# EAGLE design brick_i2c_ktemp (EAGLE 7.4.0)
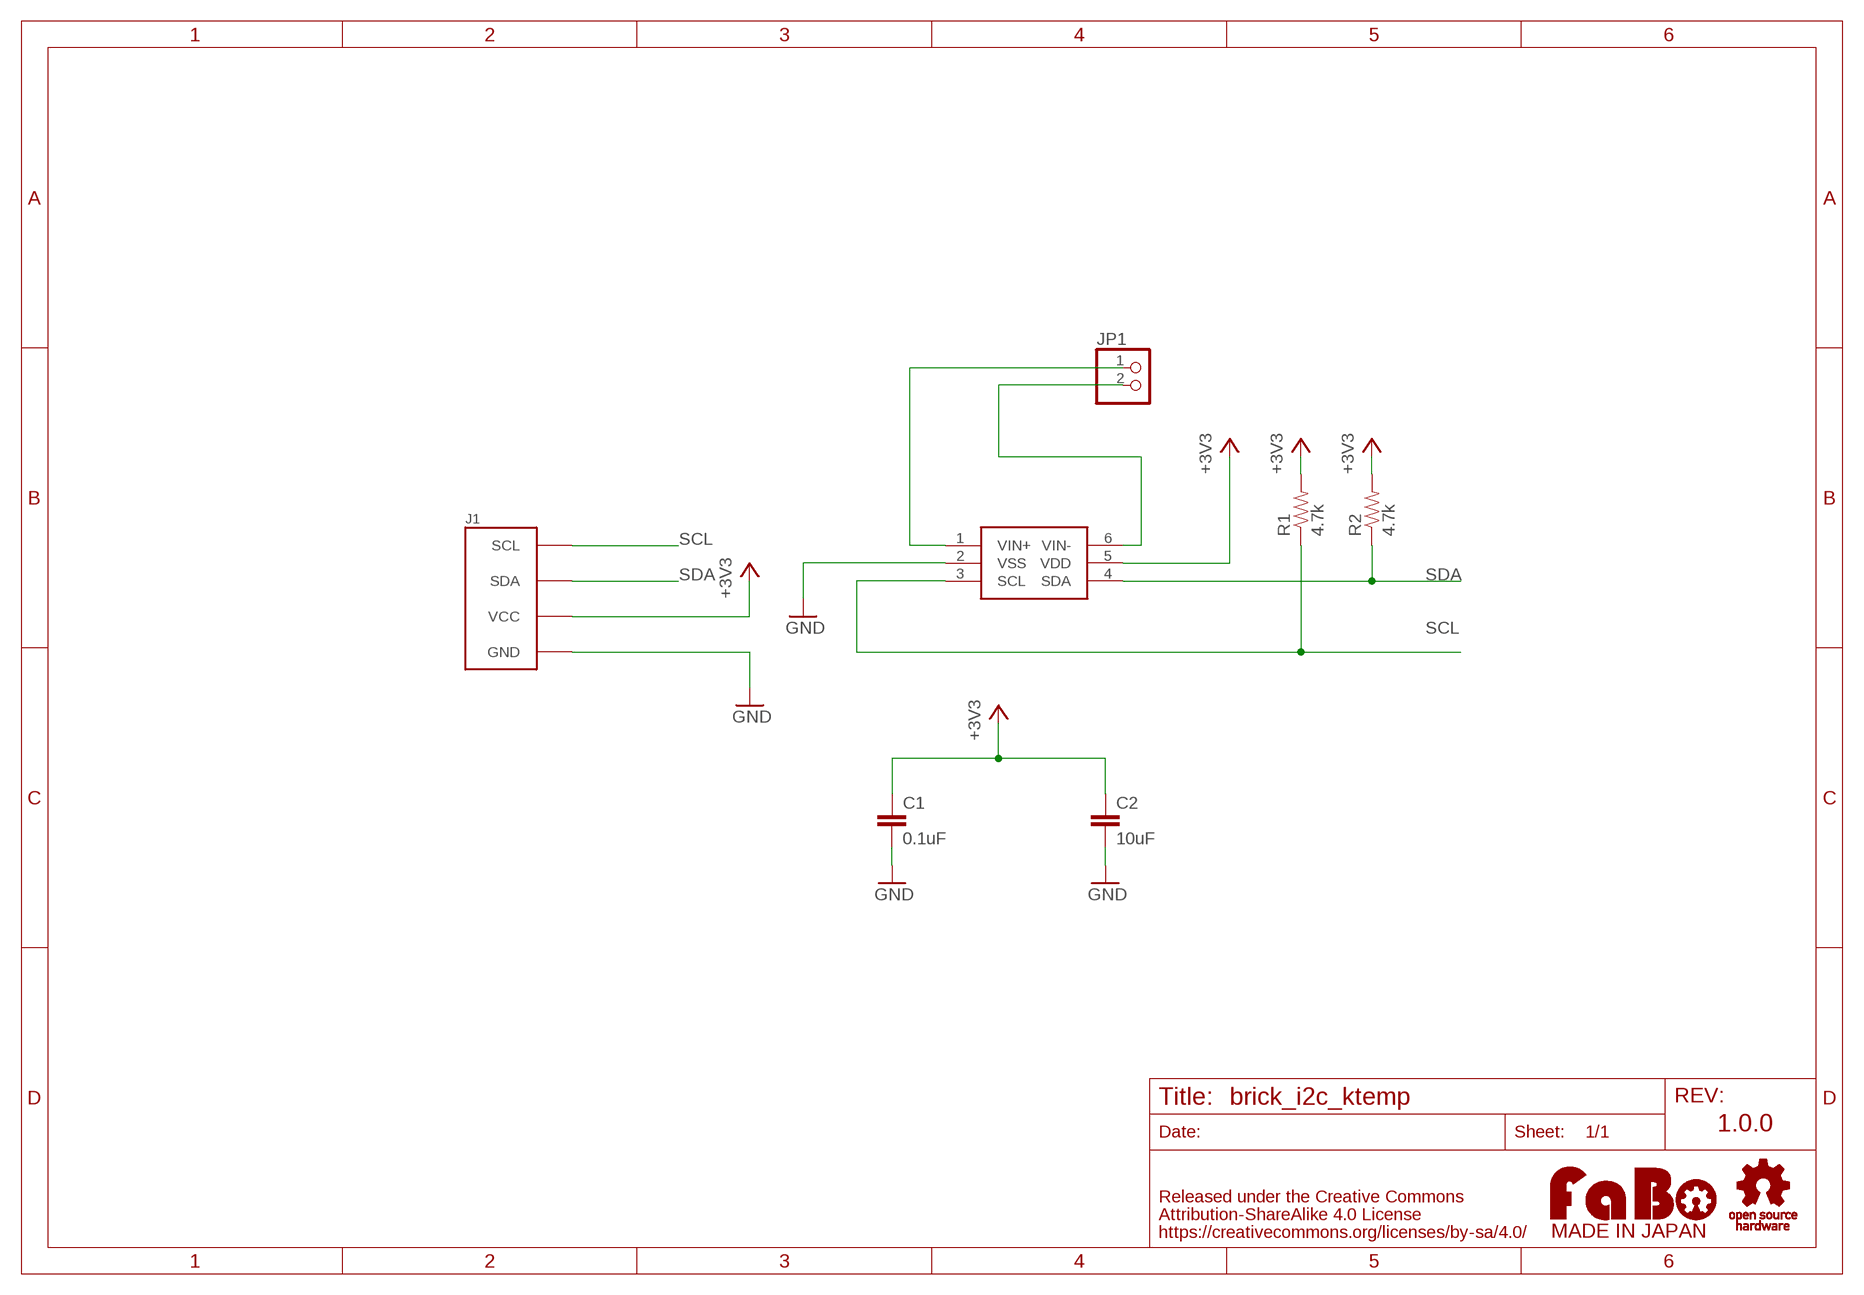
[diagram p0: schematic, sheet 1]

## Parts
C1  0.1uF  CAP-EIA0603  [EIA0603]
C2  10uF  CAP-EIA0603  [EIA0603]
J1  BRICK_I2C  [BRICK_I2C]
JP1  PINHD-1X2  [1X02]
R1  4.7k  RES-EIA0603  [EIA0603]
R2  4.7k  RES-EIA0603  [EIA0603]
U$2  MICROCHIP-MCP3421  [MICROCHIP-MCP3421]
U$3  LOGO_OSHW_T-M  [LOGO_OSHW_T_M]
U$4  LOGO_FABO-M  [LOGO_FABO_M]

## Nets
+3V3: C1.1 C2.1 J1.VCC R1.2 R2.2 U$2.5(VDD)
GND: C1.2 C2.2 J1.GND U$2.2(VSS)
N$1: JP1.2 U$2.6(VIN-)
N$3: JP1.1 U$2.1(VIN+)
SCL: J1.SCL R1.1 U$2.3(SCL)
SDA: J1.SDA R2.1 U$2.4(SDA)

## Notes on the sheet
- 1.0.0

## Library data of the parts
C1 C2 = gclue:CAP: Capacitor Standard 0603 ceramic capacitor
J1 = gclue:BRICK_I2C: FaBo Brick 4pin(I2C)
JP1 = pinhead:PINHD-1X2: PIN HEADER
R1 R2 = gclue:RES
U$2 = gclueSensor:MICROCHIP-MCP3421
U$3 = gclue:LOGO_OSHW_T
U$4 = FaBo-etc:LOGO_FABO

## Net classes
0 default: width 0.305 mm

## Board
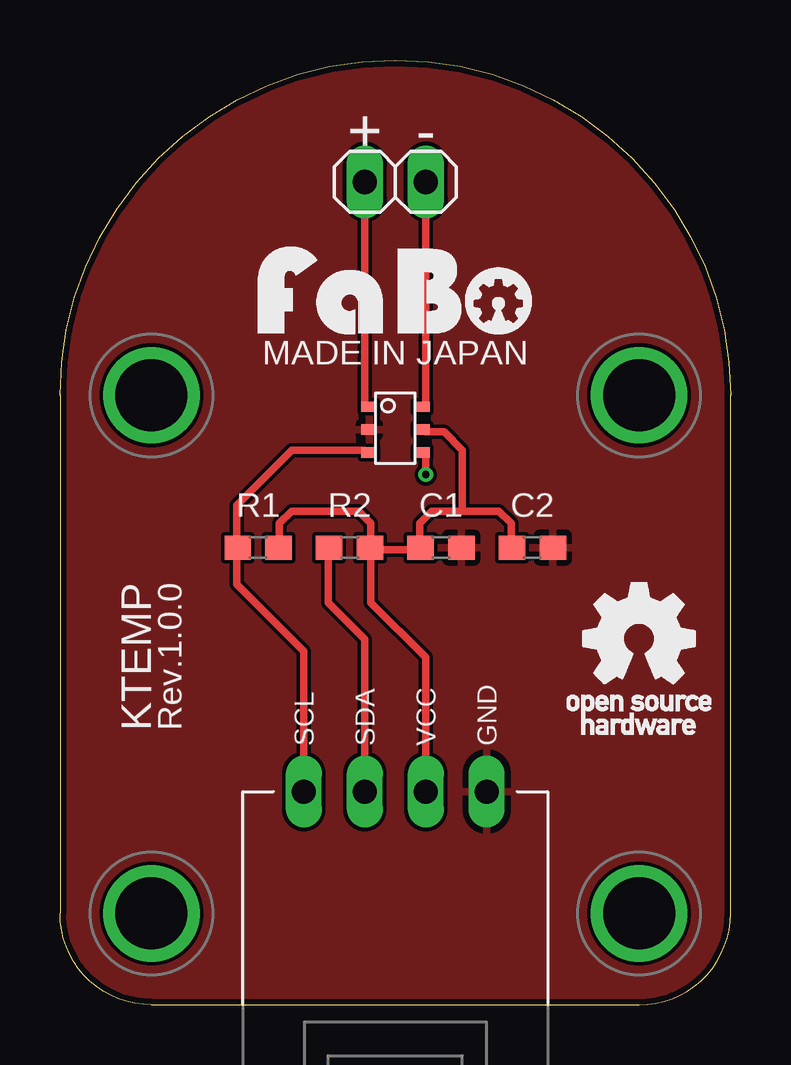
[diagram p1: board, top side]
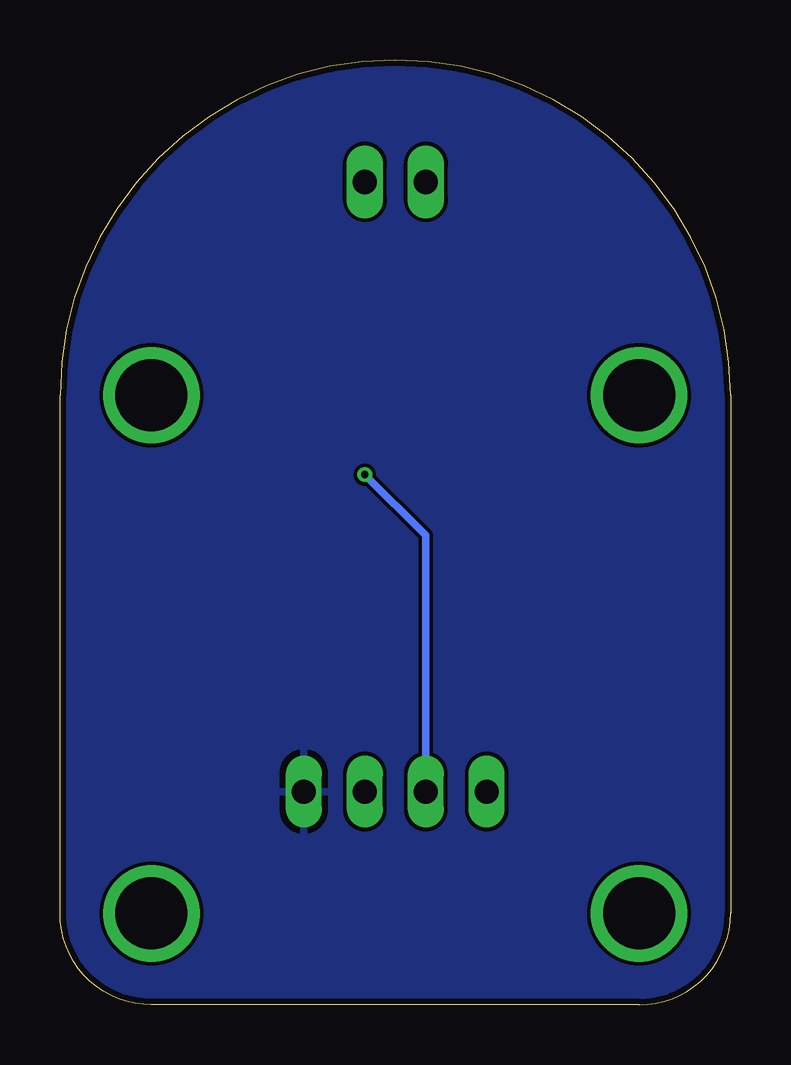
[diagram p2: board, bottom side, seen from below]

Size 27.94 x 39.37 mm. Coordinates in mm from the lower left corner, seen from the top.
Copper layers (1*16): Top 0.035mm / dielectric 1.5mm / Bottom 0.035mm
Design rules "Elecrow_2-layer_eagle_rule": minimum track width 6mil, minimum drill 12mil, track to track 6mil, track to pad 6mil, pad to pad 6mil, via to via 6mil, smd to smd 0mil, copper to edge 10mil, drill to drill 10mil, minimum pad ring 10mil, minimum via ring 6mil, stop-mask expansion 2mil, vias tented up to drill 100mil, thermal gap 10mil

### Footprints (pad centres in the part's own frame; a part is rotated, then mirrored left to right if it is on the bottom)
EIA0603 = smd 1.1 x 1: 1 -0.85,0; 2 0.85,0
BRICK_I2C = drill 1 long: GND 3.81,-10.16; SCL -3.81,-10.16; SDA -1.27,-10.16; VCC 1.27,-10.16 | drill 3 pad 3.81: P$1 -10.16,6.35; P$2 10.16,6.35; P$3 -10.16,-15.24; P$4 10.16,-15.24
1X02 = drill 1.016 long: 1 -1.27,0; 2 1.27,0
MICROCHIP-MCP3421 = smd 0.65 x 0.43: 1 -1.09,0.79; 2 -1.09,-0.16; 3 -1.09,-1.11; 4 1.11,-1.11; 5 1.11,-0.16; 6 1.11,0.79

### Placement (x,y rotation side)
C1  15.88,19.05 0 top
C2  19.68,19.05 0 top
J1  13.97,19.05 0 top
JP1  13.97,34.29 0 top
R1  8.26,19.05 0 top
R2  12.06,19.05 0 top
U$2  13.97,24.13 0 top
U$3  24.13,15.24 0 top
U$4  13.97,27.94 0 top

### Tracks (layer width: path | path; a pad name or v marks a point on that pad's centre or on a via)
+3V3
  Top 0.305: 9.14,18.97 R1.2 9.14,19.09 9.14,20.07 9.65,20.57 12.45,20.57 12.95,20.07 12.95,19.05 R2.2 | R2.2 12.95,18.8 12.95,16.76 15.24,14.48 J1.VCC | 16.76,20.57 15.49,20.57 14.99,20.07 14.99,19.3 C1.1 14.86,18.97 13.03,18.97 R2.2 | 16.76,20.57 16.76,23.11 16,23.88 15.24,23.88 15.09,24 U$2.5 | 16.76,20.57 18.29,20.57 18.8,20.07 18.8,19.3 C2.1
GND
  pour Top: -1.27,40.64 29.21,40.64 29.21,-1.27 -1.27,-1.27
  pour Bottom: -1.27,40.64 29.21,40.64 29.21,-1.27 -1.27,-1.27
N$1
  Top 0.305: U$2.6 15.24,24.89 JP1.2
N$3
  Top 0.305: JP1.1 12.7,24.89 U$2.1
SCL
  Top 0.305: U$2.3 12.7,23.11 9.65,23.11 7.37,20.83 7.37,19.3 R1.1 7.37,18.8 7.37,17.53 10.16,14.73 J1.SCL
SDA  (via drill 0.3)
  Top 0.305: J1.SDA 12.7,15.24 11.18,16.76 11.18,19.01 R2.1 | U$2.4 15.24,22.86 v15.24,22.1
  Bottom 0.305: v15.24,22.1 12.7,19.56 J1.SDA

### Text on the board
tPlace: + | - | MADE IN JAPAN | KTEMP | Rev.1.0.0